# Altium schematic sheet VC_Power.SchDoc: Power Supply
size A4; SheetNumber: 1; SheetTotal: 4; Desc1: Battery charging. battery management, and power supply regulation.; Desc2: Produces SoC voltage (Vcore, 1.8V), Peripheral Voltage (1V8D),; Desc3: three software-controlled digital supplies (VD0-VD2), and two software-; Desc4: controlled analog supplies (VA0, VA1).; FileInfo: VC_Power.SchDoc
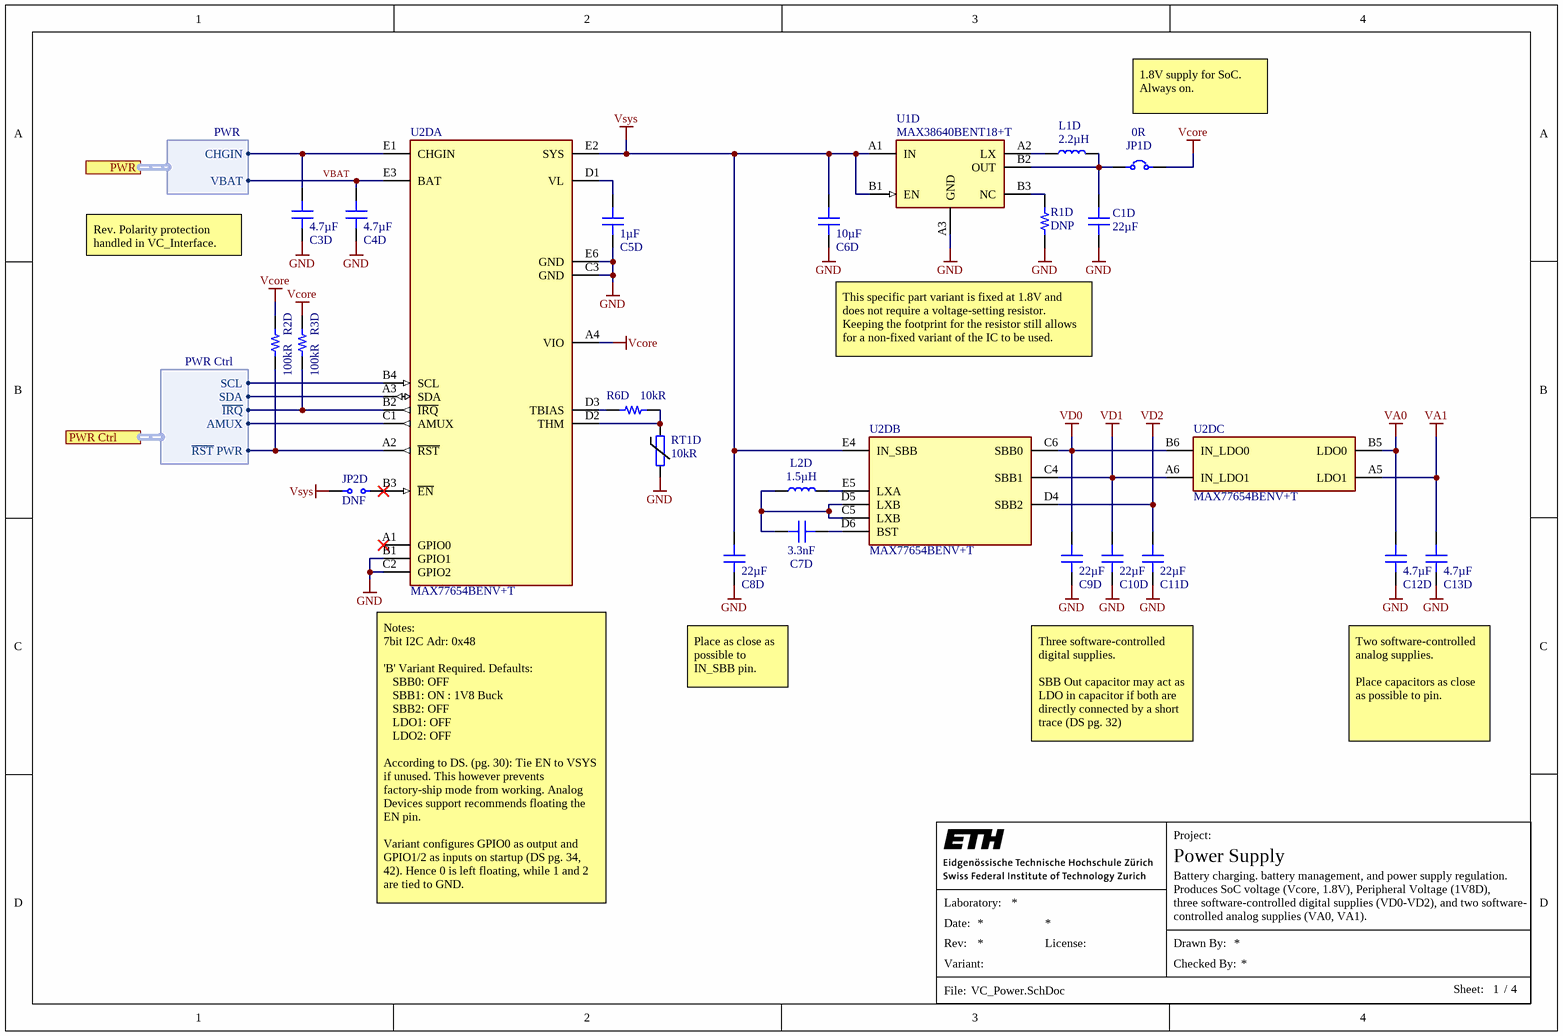
[diagram p0: VC_Power.SchDoc]

## Parts
C1D  22µF  [CAP_0402]
C3D  4.7µF  [CAP_0402]
C4D  4.7µF  [CAP_0402]
C5D  1µF  [CAP_0201]
C6D  10µF  [CAP_0402]
C7D  3.3nF  [CAP_0201]
C8D  22µF  [CAP_0603]
C9D  22µF  [CAP_0603]
C10D  22µF  [CAP_0603]
C11D  22µF  [CAP_0603]
C12D  4.7µF  [CAP_0402]
C13D  4.7µF  [CAP_0402]
JP1D  0R  [JMP_0201]
JP2D  DNF  [JMP_0201]  (no BOM)
L1D  2.2µH  [IND_0603]
L2D  1.5µH  [IND_0805_DFE201210S]
R1D  DNP  [RES_0201_DNF]  (no BOM)
R2D  100kR  [RES_0201]
R3D  100kR  [RES_0201]
R6D  10kR  [RES_0201]
RT1D  10kR  [RES_0201]
U1D  MAX38640BENT18+T  [THIN_WLP_6_MAX38640]
U2D  MAX77654BENV+T  [WLP_30_MAX77654]  (parts A,B,C of 3)

## Ports
PWR (harness PWR), PWR Ctrl (harness PWR Ctrl)

## Harnesses
PWR Ctrl: SDA, SCL, AMUX, ~{IRQ}, ~{RST} PWR
PWR: CHGIN, VBAT

## Nets
GND: C1D.1 C3D.1 C4D.1 C5D.1 C6D.1 C8D.1 C9D.1 C10D.1 C11D.1 C12D.1 C13D.1 R1D.1 RT1D.1 U1D.A3(GND) U2D.B1(GPIO1) U2D.C2(GPIO2) U2D.C3(GND) U2D.E6(GND)
VA0: C12D.2 U2D.B5(LDO0)
VA1: C13D.2 U2D.A5(LDO1)
Vcore: JP1D.2 R2D.2 R3D.2 U2D.A4(VIO)
VD0: C9D.2 U2D.B6(IN_LDO0) U2D.C6(SBB0)
VD1: C10D.2 U2D.A6(IN_LDO1) U2D.C4(SBB1)
VD2: C11D.2 U2D.D4(SBB2)
Vsys: C6D.2 C8D.2 JP2D.1 U1D.A1(IN) U1D.B1(EN) U2D.E2(SYS) U2D.E4(IN_SBB)
VBAT: C4D.2 U2D.E3(BAT) ; port PWR.VBAT
NetC1D_2: C1D.2 JP1D.1 L1D.2 U1D.B2(OUT)
NetC3D_2: C3D.2 U2D.E1(CHGIN) ; port PWR.CHGIN
NetC5D_2: C5D.2 U2D.D1(VL)
NetC7D_1: C7D.1 L2D.1 U2D.C5(LXB) U2D.D5(LXB)
NetC7D_2: C7D.2 U2D.D6(BST)
NetJP2D_2: JP2D.2 U2D.B3(~{EN})
NetL1D_1: L1D.1 U1D.A2(LX)
NetL2D_2: L2D.2 U2D.E5(LXA)
NetR1D_2: R1D.2 U1D.B3(NC)
NetR2D_1: R2D.1 U2D.A2(~{RST}) ; port PWR Ctrl.~{RST} PWR
NetR3D_1: R3D.1 U2D.B2(~{IRQ}) ; port PWR Ctrl.~{IRQ}
NetR6D_1: R6D.1 RT1D.2 U2D.D2(THM)
NetR6D_2: R6D.2 U2D.D3(TBIAS)
NetU2D_A3: U2D.A3(SDA) ; port PWR Ctrl.SDA
NetU2D_B4: U2D.B4(SCL) ; port PWR Ctrl.SCL
NetU2D_C1: U2D.C1(AMUX) ; port PWR Ctrl.AMUX

Not connected (* = marked no-connect by the designer): U2D A1(GPIO0)*

## Notes on the sheet
- 1.8V supply for SoC. Always on.
- Rev. Polarity protection handled in VC_Interface.
- This specific part variant is fixed at 1.8V and does not require a voltage-setting resistor. Keeping the footprint for the resistor still allows for a non-fixed variant of the IC to be used.
- Place as close as possible to IN_SBB pin.
- Three software-controlled digital supplies.
  SBB Out capacitor may act as LDO in capacitor if both are directly connected by a short trace (DS pg. 32)
- Two software-controlled analog supplies.
  Place capacitors as close as possible to pin.
- (near U2D) Notes:
  7bit I2C Adr: 0x48
  'B' Variant Required. Defaults:
  SBB0: OFF
  SBB1: ON : 1V8 Buck
  SBB2: OFF
  LDO1: OFF
  LDO2: OFF
  According to DS. (pg. 30): Tie EN to VSYS if unused. This however prevents factory-ship mode from working. Analog Devices support recommends floating the EN pin.
  Variant configures GPIO0 as output and GPIO1/2 as inputs on startup (DS pg. 34, 42). Hence 0 is left floating, while 1 and 2 are tied to GND.
- Project:
- Laboratory:
- Date:
- File:
- Rev:
- Variant:
- License:
- Drawn By:
- Checked By:
- Sheet:
- /

## Library data of the parts
C1D = CAP_0402_22u_6V3: CAP CER 22UF 6.3V X5R 0402; Manufacturer: Kyocera AVX; Manufacturer Part Number: CM05X5R226M06AH080; Supplier 1: Mouser; Supplier Part Number 1: 346-CM05X5R226M6AH80
C3D C4D C12D C13D = CAP_0402_4.7u_16V: CAP CER 4.7UF 16V X5R 0402; Manufacturer: Kyocera AVX; Manufacturer Part Number: 0402YD475MAT2A; Supplier 1: Mouser; Supplier Part Number 1: 581-0402YD475MAT2A
C5D = CAP_0201_1u_10V: CAP CER 1UF 10V X6S; Manufacturer: Murata; Manufacturer Part Number: GRM033C81A105ME05D; Supplier 1: Mouser; Supplier Part Number 1: 81-GRM033C81A105ME5D
C6D = CAP_0402_10u_10V: CAP CER 10UF 10V X5R 0402; Manufacturer: Samsung; Manufacturer Part Number: CL05A106MP5NUNC; Supplier 1: Mouser; Supplier Part Number 1: 187-CL05A106MP5NUNC
C7D = CAP_0201_3.3n_16V: CAP CER 3.3NF 16V X7R 0201; Manufacturer: Murata; Manufacturer Part Number: GRM033R71C332KA88D; Supplier 1: Mouser; Supplier Part Number 1: 81-GRM033R71C332KA88
C8D C9D C10D C11D = CAP_0603_22u_10V: CAP CER 22UF 10V X7R 0603; Manufacturer: Murata; Manufacturer Part Number: GRM187R61A226ME15D; Supplier 1: Mouser; Supplier Part Number 1: 81-GRM187R61A226ME5D
JP1D = JMP_0201: ERJ Series 0201 0 Ohm 0.05 W Jumper Surface Mount Thick Film Chip Resistor; Manufacturer: Panasonic; Manufacturer Part Number: ERJ-1GN0R00C; Supplier 1: Mouser; Supplier Part Number 1: 667-ERJ-1GN0R00C
JP2D = JMP_0201_DNF: JMP 0201 NO TRACE DNF
L1D = L_0603_2.2uH_520mA: L 2.2uH 520mA 0603; Manufacturer: Taiyo Yuden; Manufacturer Part Number: MBKK1608T2R2M; Supplier 1: Mouser; Supplier Part Number 1: 963-MBKK1608T2R2M
L2D = L_0805_1.5uH_2A: L 1.5uH 2A 0805; Manufacturer: Murata; Manufacturer Part Number: DFE201210S-1R5M=P2; Supplier 1: Mouser; Supplier Part Number 1: 81-DFE201210S-1R5MP2
R1D = R_0201_DNP: R DNP 0201
R2D R3D = R_0201_100K: R 100K 1% 50mW 0201; Manufacturer: Panasonic; Manufacturer Part Number: ERJ-1GNF1003C; Supplier 1: Mouser; Supplier Part Number 1: 667-ERJ-1GNF1003C
R6D = R_0201_10K: R 10K 1% 50mW 0201; Manufacturer: Panasonic; Manufacturer Part Number: ERJ-1GNF1002C; Supplier 1: Mouser; Supplier Part Number 1: 667-ERJ-1GNF1002C
RT1D = NTC_0201_10k: NTC 10K 1% 0201 3380K; Manufacturer: Panasonic; Manufacturer Part Number: ERTJZEG103FA; Supplier 1: Mouser; Supplier Part Number 1: 667-ERT-JZEG103FA
U1D = MAX38640BENT18+T: Buck Switching Regulator IC Positive Fixed 1.8V 1 Output 175mA 6-WLP; Manufacturer: Maxim; Supplier 1: Mouser; Supplier Part Number 1: 700-MAX38640BENT18T; Manufacturer Part Number: MAX38640BENT18+T
U2D = MAX77654BENV+T: Buck-Boost Converter With LDO Regulator 5-OUT 30-Pin WLP T/R; Manufacturer: Maxim; Supplier 1: Mouser; Manufacturer Part Number: MAX77654BENV+T; Supplier Part Number 1: 700-MAX77654BENV+T